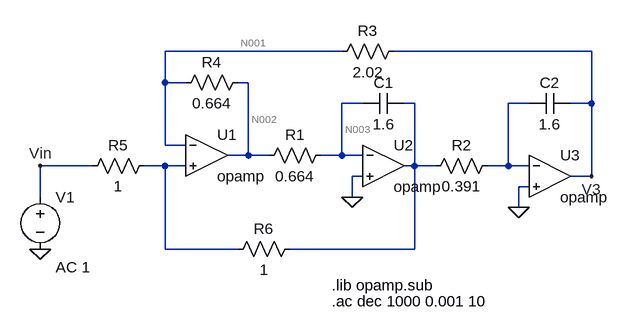
[diagram p0: schematic circuito simulación T2 normalizado.asc]
circuito simulación T2 normalizado.asc, the LTspice schematic file:
Version 4
SHEET 1 880 680
WIRE 240 -48 -32 -48
WIRE 624 -48 320 -48
WIRE -32 0 -32 -48
WIRE 0 0 -32 0
WIRE 96 0 80 0
WIRE 272 32 240 32
WIRE 352 32 336 32
WIRE 528 32 496 32
WIRE 624 32 624 -48
WIRE 624 32 592 32
WIRE -32 96 -32 0
WIRE 0 96 -32 96
WIRE 96 112 96 0
WIRE 96 112 64 112
WIRE 128 112 96 112
WIRE 240 112 240 32
WIRE 240 112 208 112
WIRE 272 112 240 112
WIRE -144 128 -224 128
WIRE -32 128 -64 128
WIRE 0 128 -32 128
WIRE 352 128 352 32
WIRE 352 128 336 128
WIRE 384 128 352 128
WIRE 496 128 496 32
WIRE 496 128 464 128
WIRE 528 128 496 128
WIRE 272 144 256 144
WIRE 624 144 624 32
WIRE 624 144 592 144
WIRE 528 160 512 160
WIRE -224 176 -224 128
WIRE 256 176 256 144
WIRE 512 192 512 160
WIRE -32 256 -32 128
WIRE 80 256 -32 256
WIRE 352 256 352 128
WIRE 352 256 160 256
FLAG 256 176 0
FLAG 512 192 0
FLAG -224 128 Vin
FLAG 624 144 V3
FLAG -224 256 0
SYMBOL OpAmps\\opamp 304 64 R0
SYMATTR InstName U2
SYMBOL OpAmps\\opamp 560 80 R0
SYMATTR InstName U3
SYMBOL res 224 96 R90
WINDOW 0 0 56 VBottom 2
WINDOW 3 32 56 VTop 2
SYMATTR InstName R1
SYMATTR Value 0.664
SYMBOL res 480 112 R90
WINDOW 0 0 56 VBottom 2
WINDOW 3 32 56 VTop 2
SYMATTR InstName R2
SYMATTR Value 0.391
SYMBOL res 336 -64 R90
WINDOW 0 0 56 VBottom 2
WINDOW 3 32 56 VTop 2
SYMATTR InstName R3
SYMATTR Value 2.02
SYMBOL res 96 -16 R90
WINDOW 0 0 56 VBottom 2
WINDOW 3 32 56 VTop 2
SYMATTR InstName R4
SYMATTR Value 0.664
SYMBOL res -48 112 R90
WINDOW 0 0 56 VBottom 2
WINDOW 3 32 56 VTop 2
SYMATTR InstName R5
SYMATTR Value 1
SYMBOL res 176 240 R90
WINDOW 0 0 56 VBottom 2
WINDOW 3 32 56 VTop 2
SYMATTR InstName R6
SYMATTR Value 1
SYMBOL cap 336 16 R90
WINDOW 0 0 32 VBottom 2
WINDOW 3 32 32 VTop 2
SYMATTR InstName C1
SYMATTR Value 1.6
SYMBOL cap 592 16 R90
WINDOW 0 0 32 VBottom 2
WINDOW 3 32 32 VTop 2
SYMATTR InstName C2
SYMATTR Value 1.6
SYMBOL voltage -224 160 R0
WINDOW 123 24 124 Left 2
WINDOW 39 0 0 Left 0
SYMATTR InstName V1
SYMATTR Value ""
SYMATTR Value2 AC 1
SYMBOL OpAmps\\opamp 32 48 R0
SYMATTR InstName U1
TEXT 224 312 Left 2 !.lib opamp.sub
TEXT 224 336 Left 2 !.ac dec 1000 0.001 10

The netlist it stands for:
* circuito simulación T2 normalizado.asc
XU2 N003 0 N004 opamp Aol=100K GBW=10Meg  ; pins invin noninvin out
XU3 N005 0 V3 opamp Aol=100K GBW=10Meg  ; pins invin noninvin out
R1 N003 N002 0.664
R2 N005 N004 0.391
R3 V3 N001 2.02
R4 N002 N001 0.664
R5 N006 Vin 1
R6 N004 N006 1
C1 N004 N003 1.6
C2 V3 N005 1.6
V1 Vin 0 AC 1
XU1 N001 N006 N002 opamp Aol=100K GBW=10Meg  ; pins invin noninvin out
.lib opamp.sub
.ac dec 1000 0.001 10
.backanno
.end

* Results of the author's LTspice run, read from the files saved beside the schematic
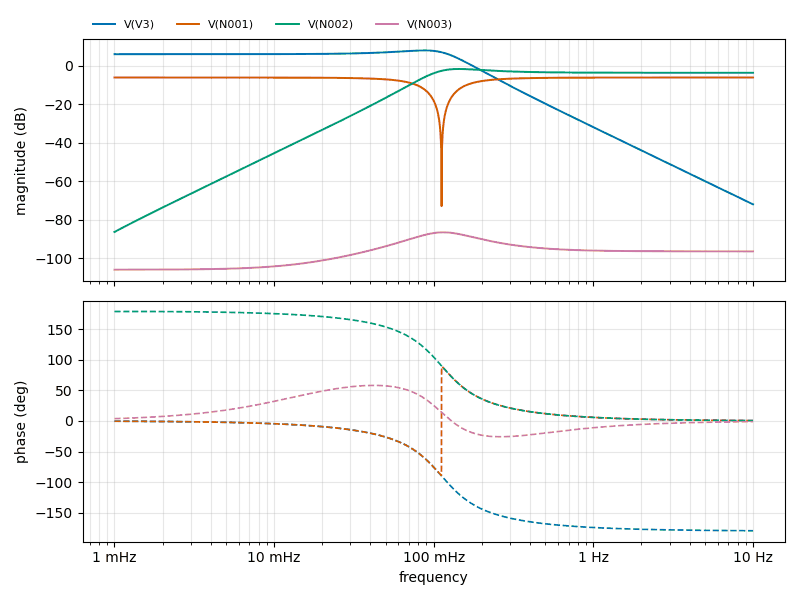
[diagram p1: AC Analysis of circuito simulación T2 normalizado.asc, plotted from the saved traces]
* AC Analysis, 1 run:
*   V(V3): 6.11 dB at 1 mHz, -72.02 dB at 10 Hz, peak 8.09 dB at 87.1 mHz, 3 dB below the peak at 132.5 mHz
*   V(N001): -6.02 dB at 1 mHz, -6.02 dB at 10 Hz, peak -6.02 dB at 1 mHz, 3 dB below the peak at 72.73 mHz
*   V(N002): -86.37 dB at 1 mHz, -3.55 dB at 10 Hz, peak -1.58 dB at 143.9 mHz, 3 dB below the peak at 94.55 mHz
*   V(N003): -106.00 dB at 1 mHz, -96.47 dB at 10 Hz, peak -86.56 dB at 114.6 mHz, 3 dB below the peak at 74.48 mHz and 186.4 mHz